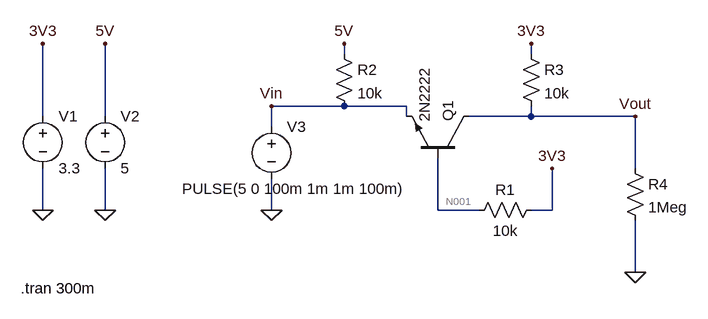
[diagram p0: schematic Draft1.asc]
Draft1.asc, the LTspice schematic file:
Version 4
SHEET 1 880 680
WIRE -48 64 -48 48
WIRE 240 64 240 48
WIRE -48 144 -160 144
WIRE 48 144 -48 144
WIRE -512 160 -512 48
WIRE -416 160 -416 48
WIRE 48 160 48 144
WIRE 240 160 240 144
WIRE 240 160 144 160
WIRE 400 160 240 160
WIRE -160 176 -160 144
WIRE 400 240 400 160
WIRE -512 304 -512 240
WIRE -416 304 -416 240
WIRE -160 304 -160 256
WIRE 96 304 96 224
WIRE 160 304 96 304
WIRE 272 304 272 240
WIRE 272 304 240 304
WIRE 400 400 400 320
FLAG 400 400 0
FLAG -512 304 0
FLAG -416 304 0
FLAG -512 48 3V3
FLAG -416 48 5V
FLAG -48 48 5V
FLAG 240 48 3V3
FLAG 272 240 3V3
FLAG -160 304 0
FLAG -160 144 Vin
FLAG 400 160 Vout
SYMBOL npn 144 224 M270
SYMATTR InstName Q1
SYMATTR Value 2N2222
SYMBOL res 256 288 R90
WINDOW 0 0 56 VBottom 2
WINDOW 3 32 56 VTop 2
SYMATTR InstName R1
SYMATTR Value 10k
SYMBOL res -64 48 R0
SYMATTR InstName R2
SYMATTR Value 10k
SYMBOL res 224 48 R0
SYMATTR InstName R3
SYMATTR Value 10k
SYMBOL res 384 224 R0
SYMATTR InstName R4
SYMATTR Value 1Meg
SYMBOL voltage -512 144 R0
SYMATTR InstName V1
SYMATTR Value 3.3
SYMBOL voltage -416 144 R0
SYMATTR InstName V2
SYMATTR Value 5
SYMBOL voltage -160 160 R0
WINDOW 3 -138 111 Left 2
WINDOW 123 0 0 Left 2
WINDOW 39 0 0 Left 2
SYMATTR InstName V3
SYMATTR Value PULSE(5 0 100m 1m 1m 100m)
TEXT -546 424 Left 2 !.tran 300m

The netlist it stands for:
* Draft1.asc
Q1 Vout N001 Vin 0 2N2222
R1 3V3 N001 10k
R2 5V Vin 10k
R3 3V3 Vout 10k
R4 Vout 0 1Meg
V1 3V3 0 3.3
V2 5V 0 5
V3 Vin 0 PULSE(5 0 100m 1m 1m 100m)
.model NPN NPN
.model PNP PNP
.lib standard.bjt
.tran 300m
.backanno
.end

* Results of the author's LTspice run, read from the files saved beside the schematic
* Operating Point, zero values left out:
*   V(vout) = 3.267 V
*   V(n001) = 3.3 V
*   V(vin) = 5 V
*   V(3v3) = 3.3 V
*   V(5v) = 5 V
*   Ib(Q1) = -1.659 pA
*   Ie(Q1) = 1.736 pA
*   I(R4) = 3.267 µA
*   I(R3) = 3.267 µA
*   I(R1) = -1.659 pA
*   I(V3) = -1.737 pA
*   I(V1) = -3.267 µA
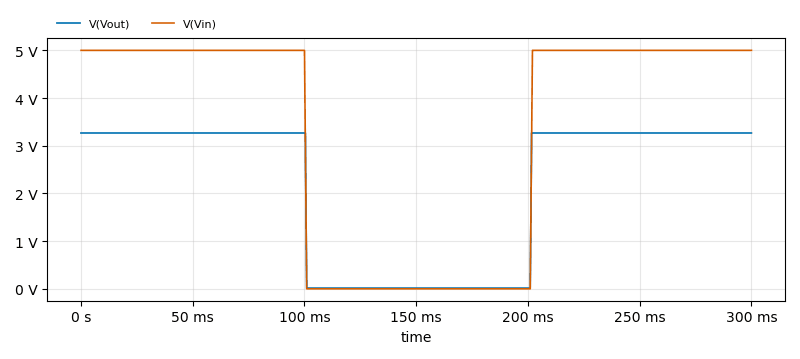
[diagram p1: Transient Analysis of Draft1.asc, plotted from the saved traces]
* Transient Analysis, 1 run:
*   V(Vout): min 14.96 mV, max 3.267 V, average 2.176 V, rms 2.662 V, last 3.267 V
*   V(Vin): min 0 V, max 5 V, average 3.317 V, rms 4.069 V, last 5 V